# EAGLE design Battle_Switch (EAGLE 6.5.0)
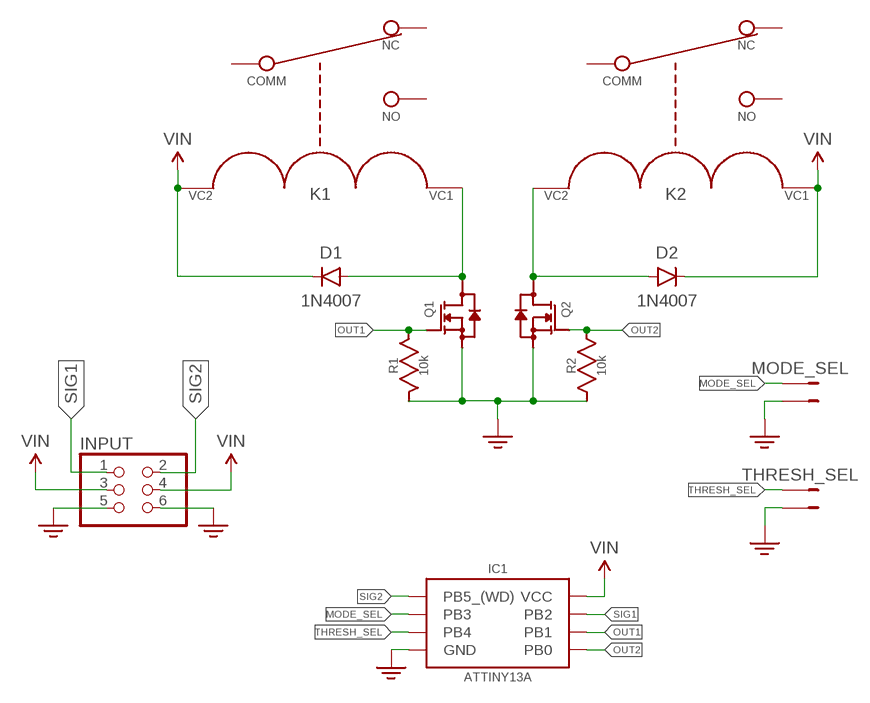
[diagram p0: schematic, sheet 1]

## Parts
D1  1N4007  DIODEPTH  [DIODE-1N4001]
D2  1N4007  DIODEPTH  [DIODE-1N4001]
IC1  ATTINY13A  [8-PDIP]
INPUT  PINHD-2X3  [2X03]
K1  AZ2100-1C-5DE  [AZ2100]
K2  AZ2100-1C-5DE  [AZ2100]
MODE_SEL  JUMPER-PTH-2-NO  [PTH-JUMPER-2-NO]
Q1  BS170  [TO-92-AMMO]
Q2  BS170  [TO-92-AMMO]
R1  10k  RESISTOR  [0411/15]
R2  10k  RESISTOR  [0411/15]
THRESH_SEL  JUMPER-PTH-2-NO  [PTH-JUMPER-2-NO]

## Nets
GND [gnd]: IC1.P$4(GND) INPUT.5 INPUT.6 MODE_SEL.P$2 Q1.1(SOURCE) Q2.1(SOURCE) R1.2 R2.1 THRESH_SEL.P$2
MODE_SEL: IC1.P$2(PB3) MODE_SEL.P$1
N$2: D1.A K1.VC1 Q1.3(DRAIN)
N$3: D2.A K2.VC2 Q2.3(DRAIN)
OUT1: IC1.P$6(PB1) Q1.2(GATE) R1.1
OUT2: IC1.P$5(PB0) Q2.2(GATE) R2.2
SIG1: IC1.P$7(PB2) INPUT.1
SIG2: IC1.P$1(PB5_(WD)) INPUT.2
THRESH_SEL: IC1.P$3(PB4) THRESH_SEL.P$1
VIN [pwr]: D1.C D2.C IC1.P$8(VCC) INPUT.3 INPUT.4 K1.VC2 K2.VC1
Unconnected: K1.COMM K1.NC K1.NO K2.COMM K2.NC K2.NO

## Library data of the parts
D1 D2 = Battle_Switch:DIODE: Diode These are standard reverse protection diodes and small signal diodes. SMA package can handle up to about 1A. SOD-323 can handle about 200mA. What the SOD-323 package when ordering, there are some mfgs out there that are 5-pin packages.
IC1 = Battle_Switch:ATTINY13A: ATtiny13A microcontroller by Atmel.
INPUT = Battle_Switch:PINHD-2X3: PIN HEADER
K1 K2 = Battle_Switch:AZ2100-1C; COIL_RESISTANCE_PLUS_MINUS_10_PERCENT: 27; MAX_CONTINUOUS_VDC: 7.3; NOMINAL_COIL_VDC: 5
MODE_SEL THRESH_SEL = Battle_Switch:JUMPER-PTH-2-NO
Q1 Q2 = Battle_Switch:BS170
R1 R2 = Battle_Switch:RESISTOR: 1/4W metal film resistor, 15mm PTH spacing

## Net classes
0 default: clearance 0.205 mm
1 pwr: width 1.778 mm, clearance 0.205 mm to class 0, clearance 0.508 mm
2 gnd: width 1.778 mm, clearance 0.205 mm to class 0, clearance 0.205 mm to class 1, clearance 0.508 mm
3 sig: width 0.406 mm, clearance 0.254 mm

## Board
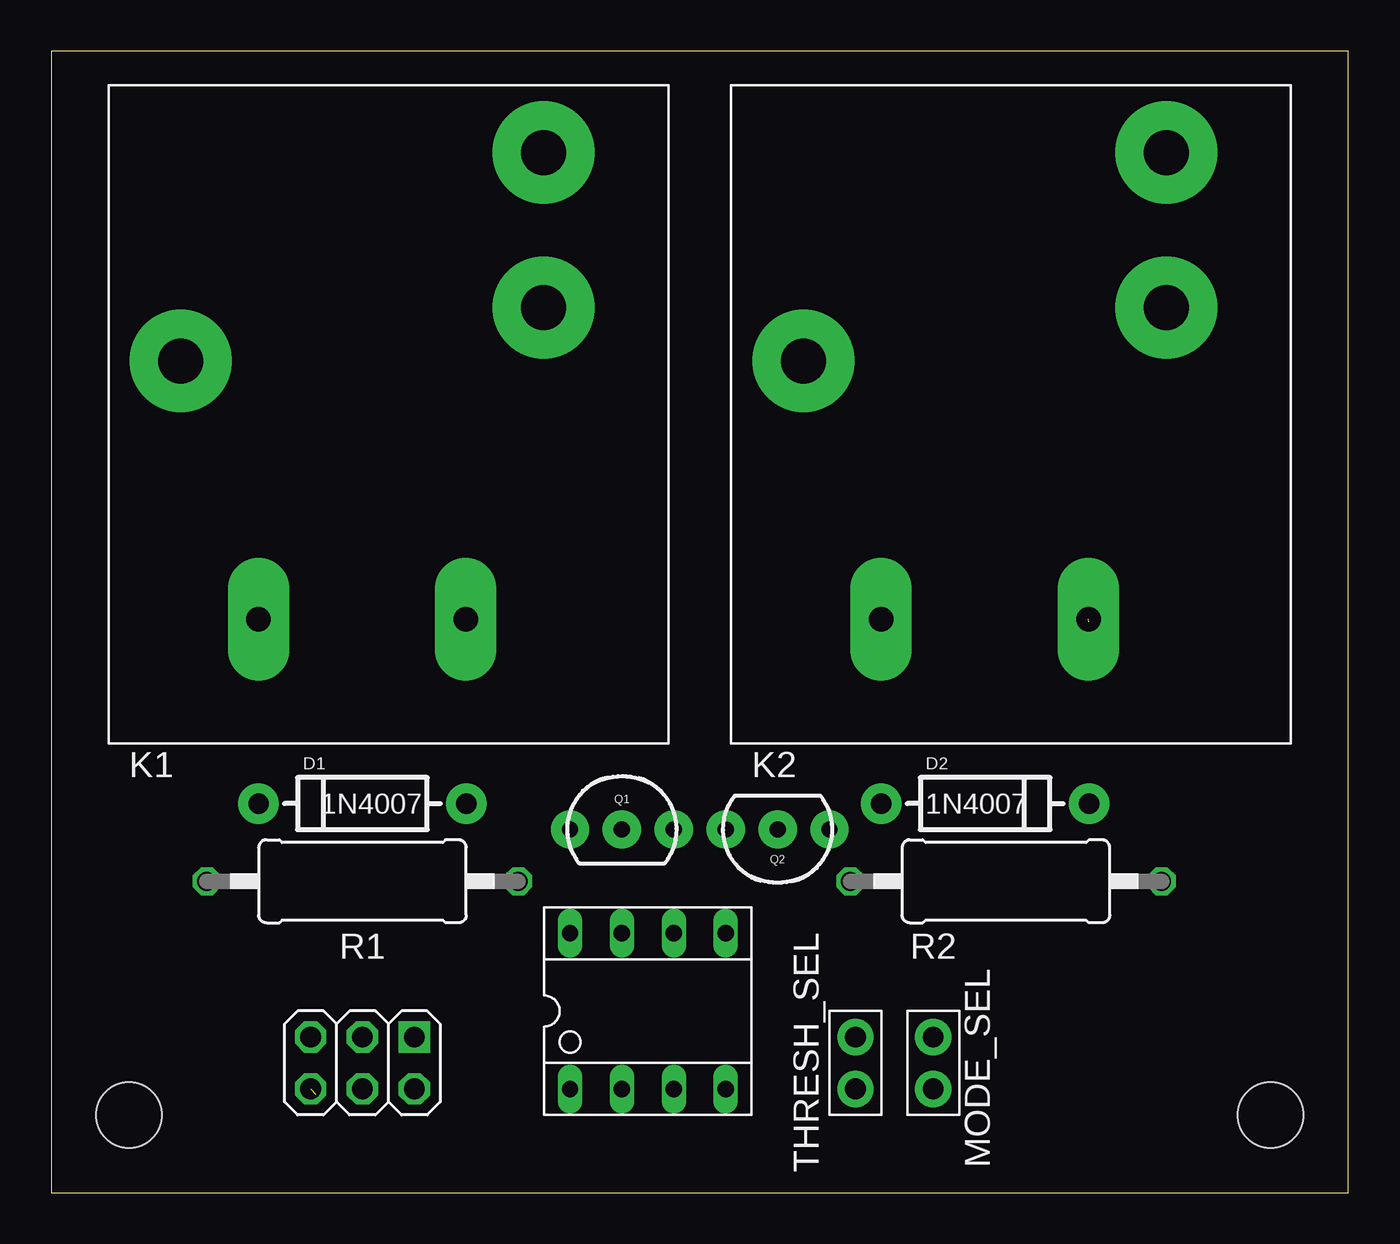
[diagram p1: board, top side]
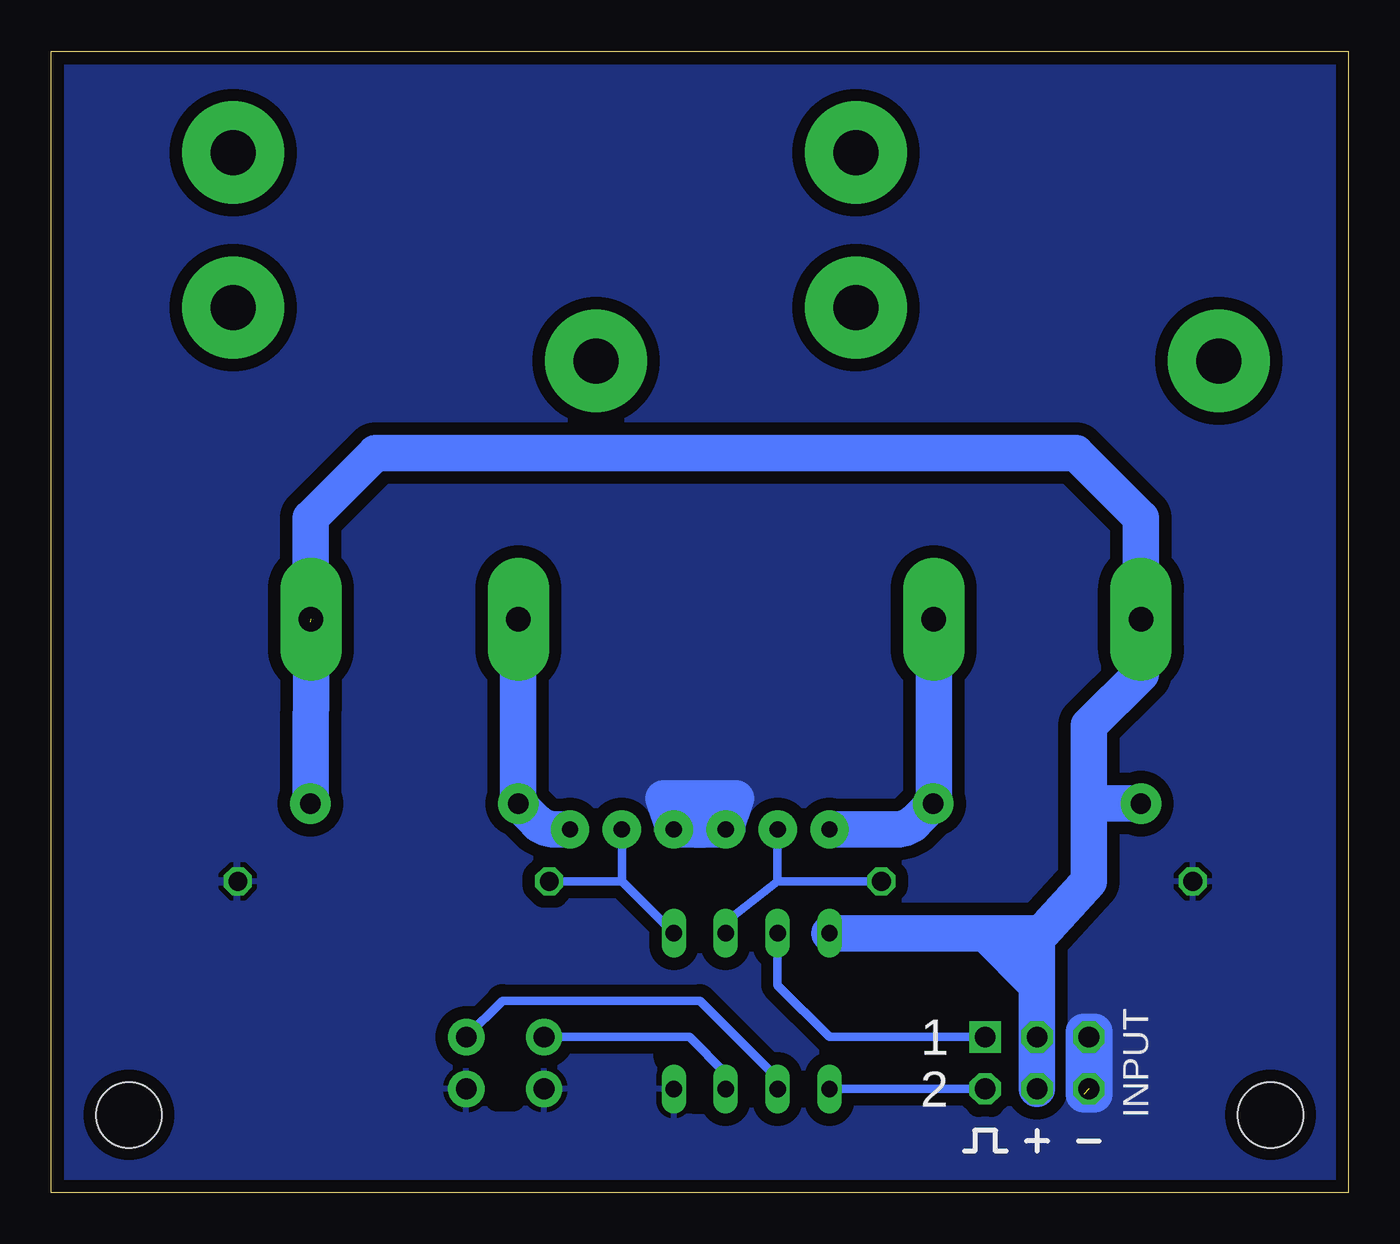
[diagram p2: board, bottom side, seen from below]

Size 63.5 x 55.88 mm. Coordinates in mm from the lower left corner, seen from the top.
Outline: 0,0 63.5,0 63.5,55.88 0,55.88 0,0
Copper layers (1*16): Top 0.0356mm / dielectric 1.5011mm / Bottom 0.0356mm
Design rules "oshpark-2layer": minimum track width 6mil, minimum drill 13mil, track to track 6mil, track to pad 6mil, pad to pad 6mil, via to via 6mil, smd to smd 6mil, copper to edge 15mil, drill to drill 6mil, minimum pad ring 7mil, minimum via ring 7mil, stop-mask expansion 4mil, vias tented up to drill 0mil, thermal gap 10mil
Holes 3.2 mm at 3.81,3.81 59.69,3.81
bRestrict: area 29.7,14.5 to 33.8,16.3; area 40.9,4.6 to 41.7,8.4; area 31.8,4.6 to 33.3,6.9

### Footprints (pad centres in the part's own frame; a part is rotated, then mirrored left to right if it is on the bottom)
DIODE-1N4001 = drill 1 pad 1.981: A -5.08,0; C 5.08,0
8-PDIP = drill 0.8 long: P$1 -3.81,-3.81; P$2 -1.27,-3.81; P$3 1.27,-3.81; P$4 3.81,-3.81; P$5 3.81,3.81; P$6 1.27,3.81; P$7 -1.27,3.81; P$8 -3.81,3.81
2X03 = drill 1.016 square: 1 -2.54,-1.27 | drill 1.016 octagon: 2 -2.54,1.27; 3 0,-1.27; 4 0,1.27; 5 2.54,-1.27; 6 2.54,1.27
AZ2100 = drill 2.2 pad 5: COMM -10.17,2.615; NC 7.6,12.815; NO 7.6,5.215 | drill 1.2 pad 3 long: VC1 3.79,-10.025; VC2 -6.36,-10.025
PTH-JUMPER-2-NO = drill 1.016 pad 1.778: P$1 -1.27,0; P$2 1.27,0
TO-92-AMMO = drill 0.8 pad 1.88: 1 2.54,0; 2 0,0; 3 -2.54,0
0411/15 = drill 0.914 octagon: 1 -7.62,0; 2 7.62,0

### Placement (x,y rotation side)
D1  15.24,19.05 180 top
D2  45.72,19.05 0 top
IC1  29.21,8.89 0 top
INPUT  15.24,6.35 180 top
K1  16.51,38.1 0 top
K2  46.99,38.1 0 top
MODE_SEL  43.18,6.35 270 top
Q1  27.94,17.78 0 top
Q2  35.56,17.78 180 top
R1  15.24,15.24 180 top
R2  46.74,15.24 180 top
THRESH_SEL  39.37,6.35 270 top

### Tracks (layer width: path | path; a pad name or v marks a point on that pad's centre or on a via)
GND  (1 unrouted)
  Bottom 1.778: Q1.1 Q2.1 33.53,19.3 29.97,19.3 Q1.1 | 12.95,4.83 12.95,7.87 12.45,7.87 12.45,4.83 12.95,4.83
  pour Bottom (isolate 0.61): 0.64,55.24 62.87,55.24 62.87,0.64 0.64,0.64
  pour Bottom: 54.61,16.51 57.15,16.51 57.15,14.22 54.61,14.22
MODE_SEL
  Bottom 0.406: IC1.P$2 27.94,5.59 31.75,9.4 41.4,9.4 MODE_SEL.P$1
N$2
  Bottom 1.778: K1.VC1 20.3,19.1 arc45 D1.A 21.22,18.15 arc45 22.12,17.78 Q1.3
N$3
  Bottom 1.778: K2.VC2 arc-45 40.64,28.05 D2.A 39.74,18.15 arc-45 38.84,17.78 Q2.3
OUT1
  Bottom 0.406: 27.94,15.24 R1.1 | 27.94,15.24 Q1.2 | IC1.P$6 30.23,13.46 27.94,15.24
OUT2
  Bottom 0.406: IC1.P$5 35.56,15.24 | R2.2 35.56,15.24 | Q2.2 35.56,15.24
SIG1
  Bottom 0.406: INPUT.1 25.4,7.62 27.94,10.16 IC1.P$7
SIG2
  Bottom 0.406: IC1.P$1 INPUT.2
THRESH_SEL
  Bottom 0.406: THRESH_SEL.P$1 32.26,7.62 30.48,5.84 IC1.P$3
VIN  (1 unrouted)
  Bottom 1.778: 50.8,27.94 50.8,33.02 47.62,36.2 13.34,36.2 10.16,33.02 10.16,27.94 | IC1.P$8 17.78,12.7 | 17.78,12.7 15.24,12.7 15.24,12.45 | 50.78,19.1 arc45 D2.C K2.VC1 | INPUT.4 INPUT.3 15.24,10.16 | 10.16,27.94 K1.VC2 | 15.24,10.16 15.24,12.45 | 15.24,12.45 12.7,15.24 12.7,19.05 | 12.7,19.05 12.7,22.86 10.16,25.4 10.16,27.94 | D1.C 12.7,19.05 | 15.24,10.16 17.78,12.7

### Text on the board
bPlace: 1 | 2